# Altium schematic sheet Comp Clipper.SchDoc
size Letter; SheetNumber: 5; SheetTotal: 14
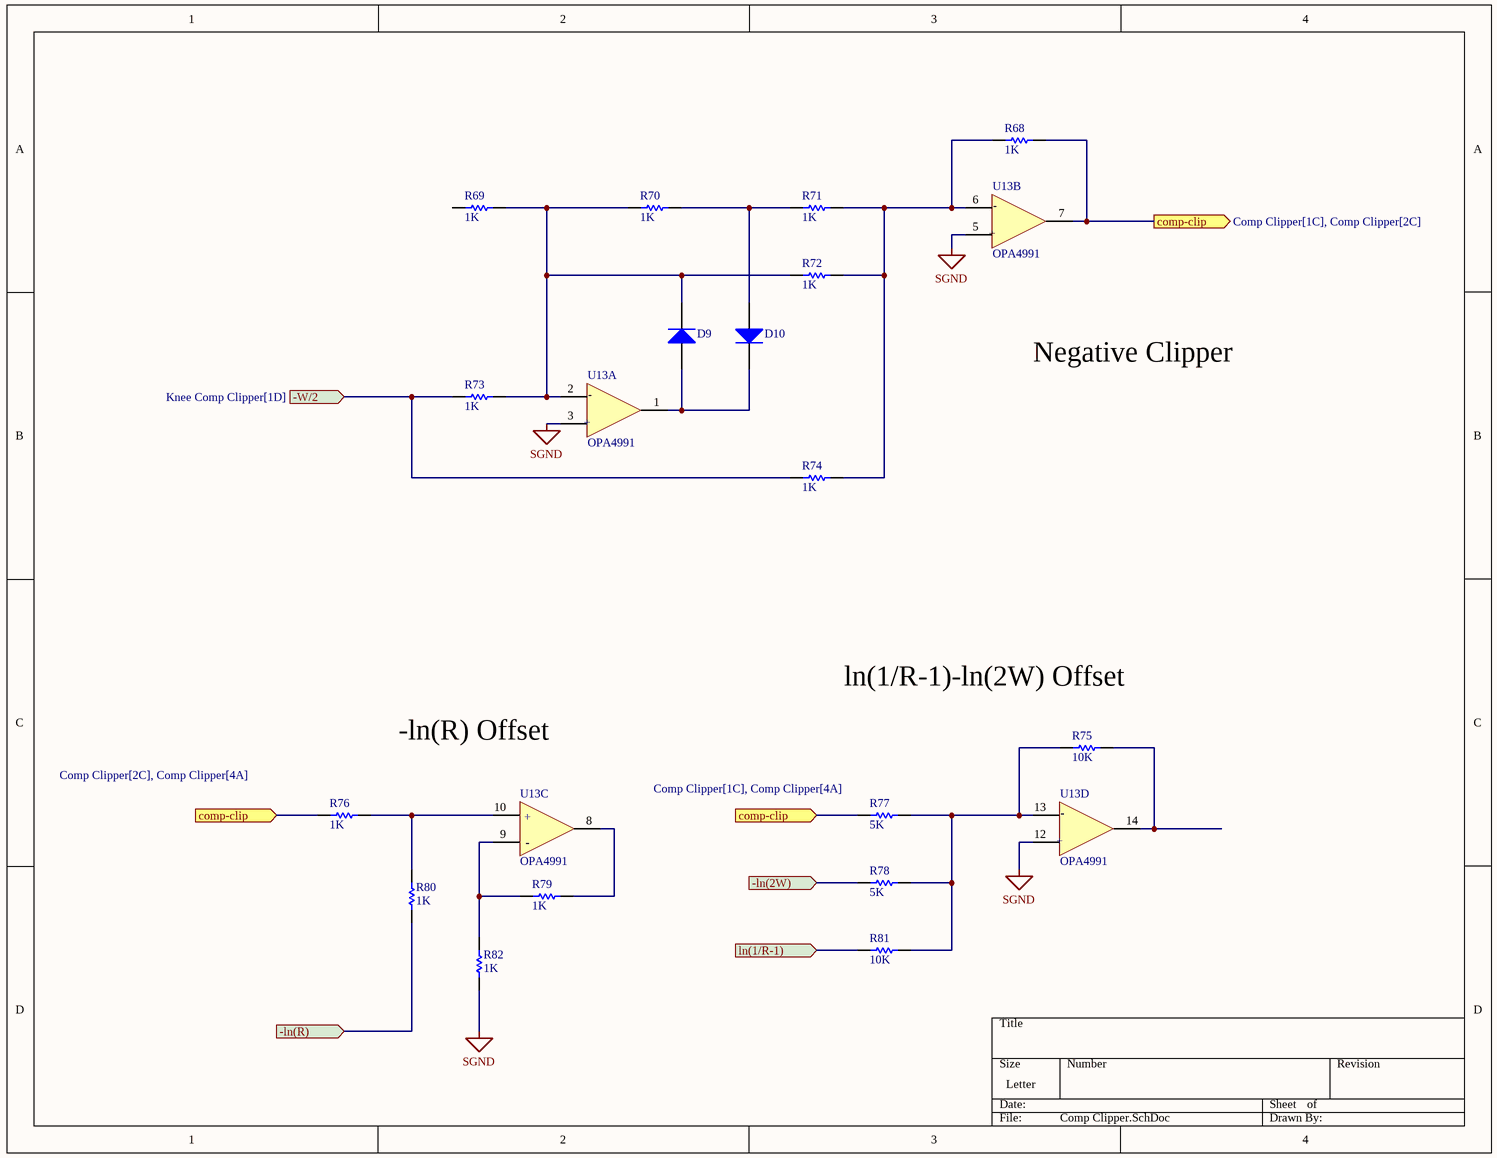
[diagram p0: Comp Clipper.SchDoc]

## Parts
D9  Diode  (value not drawn)
D10  Diode  (value not drawn)
R68  value 1K  (hidden comment: Resistor)
R69  value 1K  (hidden comment: Resistor)
R70  value 1K  (hidden comment: Resistor)
R71  value 1K  (hidden comment: Resistor)
R72  value 1K  (hidden comment: Resistor)
R73  value 1K  (hidden comment: Resistor)
R74  value 1K  (hidden comment: Resistor)
R75  value 10K  (hidden comment: Resistor)
R76  value 1K  (hidden comment: Resistor)
R77  value 5K  (hidden comment: Resistor)
R78  value 5K  (hidden comment: Resistor)
R79  value 1K  (hidden comment: Resistor)
R80  value 1K  (hidden comment: Resistor)
R81  value 10K  (hidden comment: Resistor)
R82  value 1K  (hidden comment: Resistor)
U13  OPA4991  [FP-D0014A-IPC_B]  (parts A,B,C,D of 5)

## Ports
-ln(2W) (in), -ln(R) (in), -W/2 (in, see Knee Comp Clipper[1D]), comp-clip (in, see Comp Clipper[1C], Comp Clipper[4A]), comp-clip (in, see Comp Clipper[2C], Comp Clipper[4A]), comp-clip (out, see Comp Clipper[1C], Comp Clipper[2C]), ln(1/R-1) (in)

## Nets
SGND: R82.2 U13.3(IN1+) U13.5(IN2+) U13.12(IN4+)
-ln(2W): R78.2 ; port -ln(2W)
-ln(R): R80.1 ; port -ln(R)
-W/2: R73.1 R74.1 ; port -W/2
comp-clip: R68.2 R76.1 R77.1 U13.7(OUT2) ; port comp-clip
ln(1/R-1): R81.1 ; port ln(1/R-1)
NetD9_1: D9.1(A) D10.2(K) U13.1(OUT1)
NetD9_2: D9.2(K) R69.2 R70.1 R72.1 R73.2 U13.2(IN1-)
NetD10_1: D10.1(A) R70.2 R71.1
NetR68_1: R68.1 R71.2 R72.2 R74.2 U13.6(IN2-)
NetR75_1: R75.1 U13.14(OUT4)
NetR75_2: R75.2 R77.2 R78.1 R81.2 U13.13(IN4-)
NetR76_2: R76.2 R80.2 U13.10(IN3+)
NetR79_1: R79.1 U13.8(OUT3)
NetR79_2: R79.2 R82.1 U13.9(IN3-)

Not connected (* = marked no-connect by the designer): R69 1

## Notes on the sheet
- Negative Clipper
- ln(1/R-1)-ln(2W) Offset
- -ln(R) Offset
- (in symbol OPA4991IDR, part A) -; +
- (in symbol OPA4991IDR, part B) -; +
- (in symbol OPA4991IDR, part C) +; -
- (in symbol OPA4991IDR, part D) -; +

## Library data of the parts
D9 D10 = Diode: AF: 1; BV: 0; BV_MAX: 1e99; EG: 1.11; FC: 0.5; IBV: 0.001; ISR: 1e-14; MJSW: 0.33; NTUN: 30; TNOM: 27; XTI: 3; SimulationGenericComponent: True; CJO: 0; CJP: 0; CTA: 0; CTP: 0; FCS: 0.5; FV_MAX: 1e99; IKF: 0; IKR: 0; JSW: 0; JTUN: 0; JTUNSW: 0; KEG: 1; KF: 0; LEVEL: 1; N: 1; NBV: 1; NR: 1; NS: 1; PHP: 1; RS: 0; TCV: 0; TLEV: 0; TLEVC: 0; TM1: 0; TM2: 0; TPB: 0; TPHP: 0; TRS: 0; TRS2: 0; TT: 0; TTT1: 0; TTT2: 0; VJ: 1; XTITUN: 3; IS: 1e-14
R68-R82 = Resistor: TC1: 0; SimulationGenericComponent: True; TC2: 0
U13 = OPA4991IDR: 40-V, DUAL 4.5MHZ, RAIL-TO-RAIL